# EAGLE schematic control_unit2 (EAGLE 5.11)

## Sheet 1 of 3
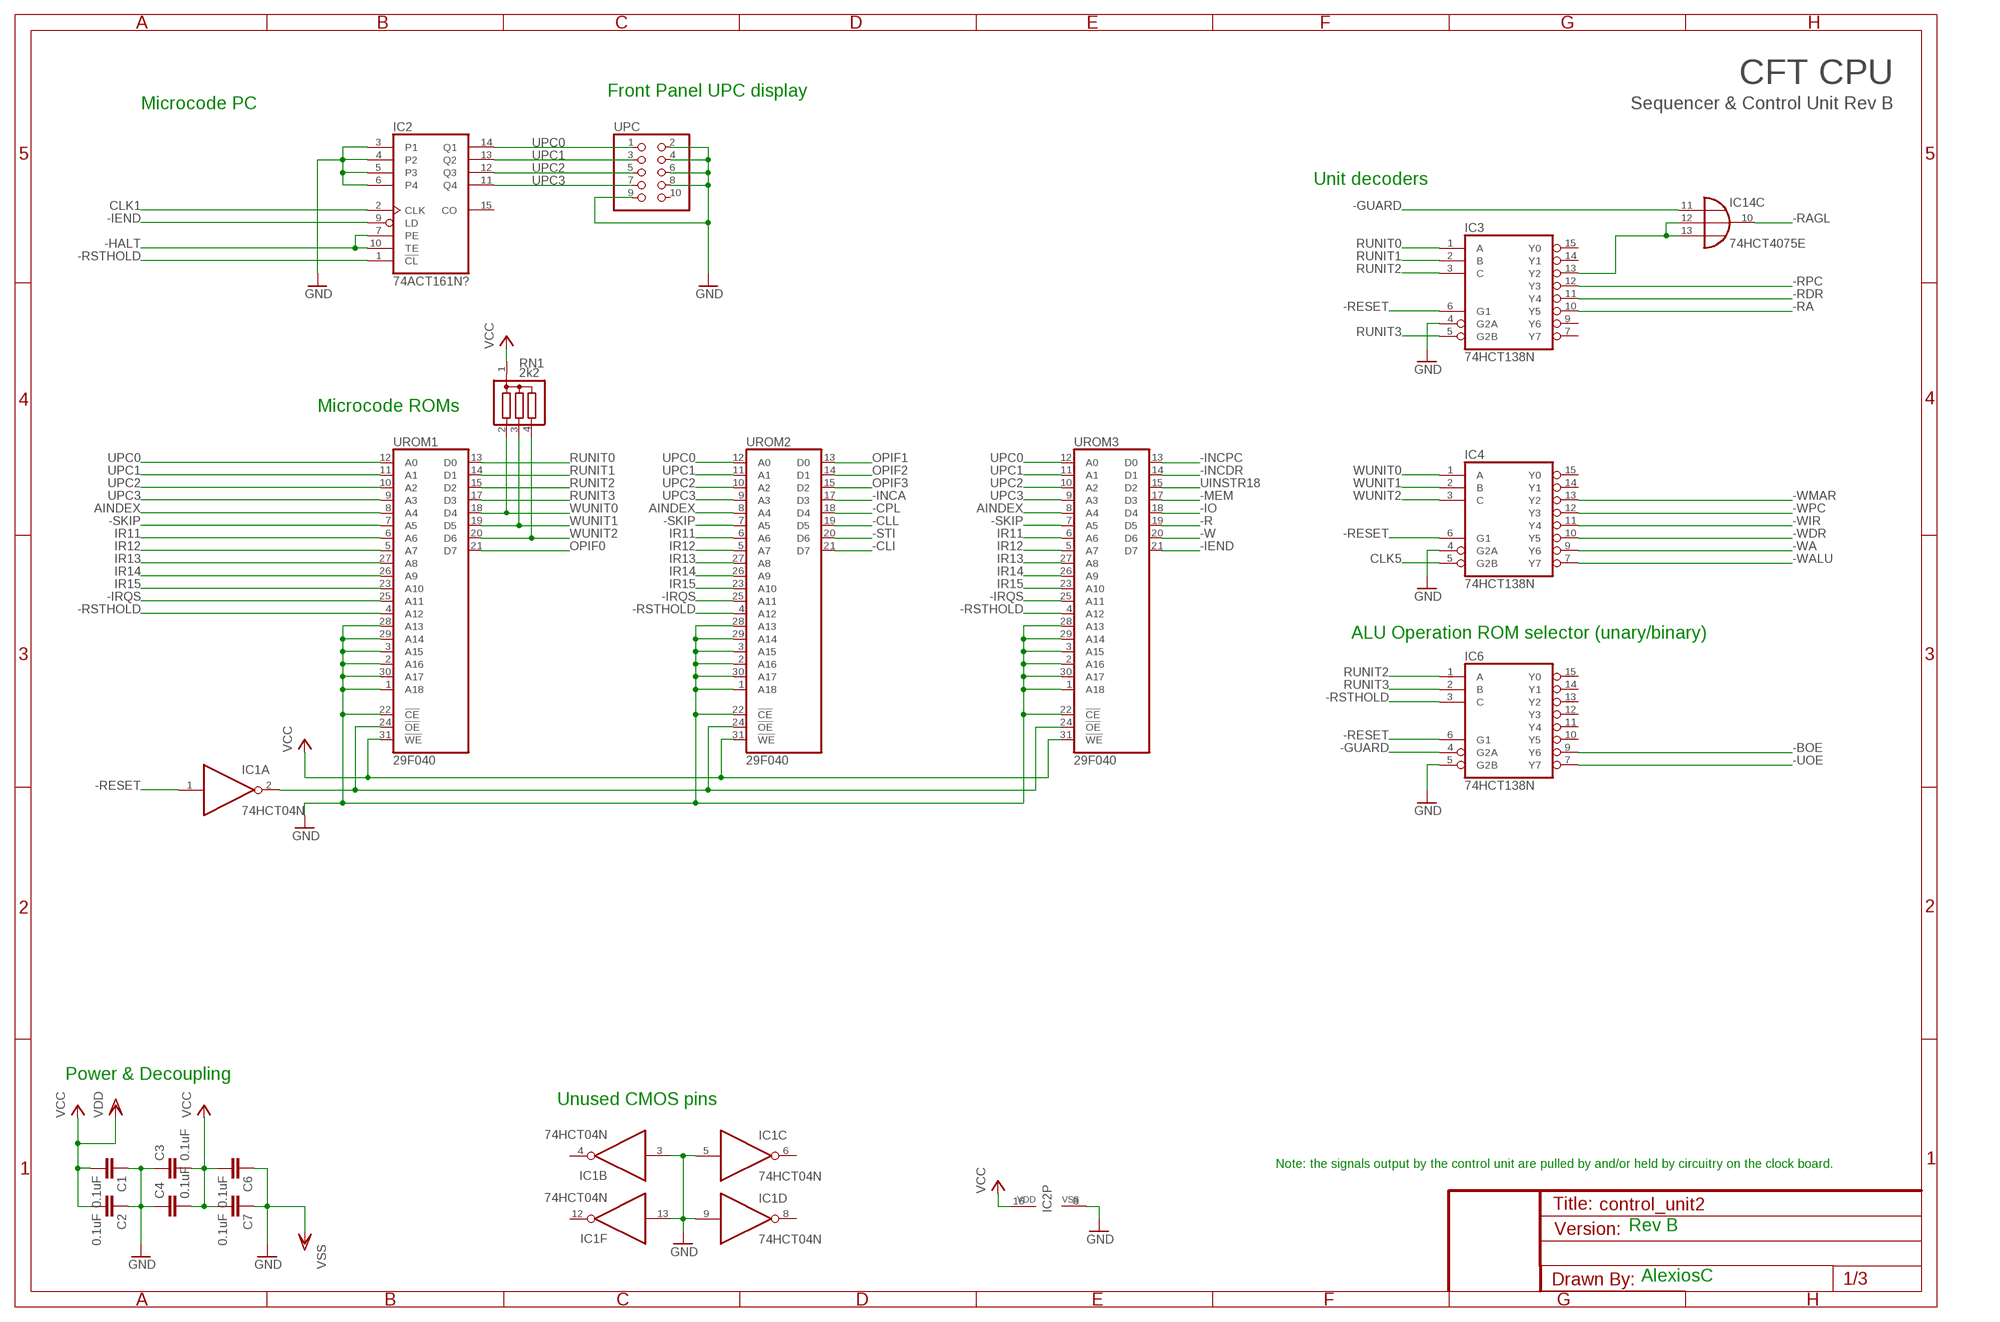
[diagram p0: schematic, sheet 1]

### Parts
C1  0.1uF  C-EU025-025X050  [C025-025X050]
C2  0.1uF  C-EU025-025X050  [C025-025X050]
C3  0.1uF  C-EU025-025X050  [C025-025X050]
C4  0.1uF  C-EU025-025X050  [C025-025X050]
C6  0.1uF  C-EU025-025X050  [C025-025X050]
C7  0.1uF  C-EU025-025X050  [C025-025X050]
IC1  74HCT04N  [DIL14]
IC2  74ACT161N?  4161P  [DIL16]
IC3  74HCT138N  [DIL16]
IC4  74HCT138N  [DIL16]
IC6  74HCT138N  [DIL16]
IC14  74HCT4075E  4075N  [DIL14]
RN1  2k2  G03R  [SIL4]
UPC  PINHD-2X5/90  [2X05/90]
UROM1  29F040  29F040DIP32  [DIL32]
UROM2  29F040  29F040DIP32  [DIL32]
UROM3  29F040  29F040DIP32  [DIL32]

### Nets
-BOE: IC6.9(Y6)
-CLI: UROM2.21(D7) ; also sheet 3
-CLL: UROM2.19(D5) ; also sheet 3
-CPL: UROM2.18(D4) ; also sheet 3
-GUARD: IC6.4(G2A) IC14.11(C:I0) ; also sheet 3
-HALT: IC2.7(PE) IC2.10(TE) ; also sheet 3
-IEND: IC2.9(LD) UROM3.21(D7) ; also sheet 3
-INCA: UROM2.17(D3) ; also sheet 3
-INCDR: UROM3.14(D1) ; also sheet 3
-INCPC: UROM3.13(D0) ; also sheet 3
-IO: UROM3.18(D4) ; also sheet 3
-IRQS: UROM1.25(A11) UROM2.25(A11) UROM3.25(A11) ; also sheet 3
-MEM: UROM3.17(D3) ; also sheet 3
-R: UROM3.19(D5) ; also sheet 3
-RA: IC3.10(Y5) ; also sheet 3
-RAGL: IC14.10(C:O) ; also sheet 3
-RDR: IC3.11(Y4) ; also sheet 3
-RESET: IC1.1(A:I) IC3.6(G1) IC4.6(G1) IC6.6(G1) ; also sheet 3
-RPC: IC3.12(Y3) ; also sheet 3
-RSTHOLD: IC2.1(!CL) IC6.3(C) UROM1.4(A12) UROM2.4(A12) UROM3.4(A12) ; also sheet 3
-SKIP: UROM1.7(A5) UROM2.7(A5) UROM3.7(A5) ; also sheet 3
-STI: UROM2.20(D6) ; also sheet 3
-UOE: IC6.7(Y7)
-W: UROM3.20(D6) ; also sheet 3
-WA: IC4.9(Y6) ; also sheet 3
-WALU: IC4.7(Y7) ; also sheet 3
-WDR: IC4.10(Y5) ; also sheet 3
-WIR: IC4.11(Y4) ; also sheet 3
-WMAR: IC4.13(Y2) ; also sheet 3
-WPC: IC4.12(Y3) ; also sheet 3
AINDEX: UROM1.8(A4) UROM2.8(A4) UROM3.8(A4) ; also sheet 3
CLK1: IC2.2(CLK) ; also sheet 3
CLK5: IC4.5(G2B) ; also sheet 3
GND [Power]: C1.1 C2.1 C3.1 C4.1 C6.1 C7.1 IC1.3(B:I) IC1.5(C:I) IC1.9(D:I) IC1.13(F:I) IC2.3(P1) IC2.4(P2) IC2.5(P3) IC2.6(P4) IC2.8(VSS) IC3.4(G2A) IC4.4(G2A) IC6.5(G2B) UPC.2 UPC.4 UPC.6 UPC.8 UPC.9 UROM1.1(A18) UROM1.2(A16) UROM1.3(A15) UROM1.22(!CE) UROM1.28(A13) UROM1.29(A14) UROM1.30(A17) UROM2.1(A18) UROM2.2(A16) UROM2.3(A15) UROM2.22(!CE) UROM2.28(A13) UROM2.29(A14) UROM2.30(A17) UROM3.1(A18) UROM3.2(A16) UROM3.3(A15) UROM3.22(!CE) UROM3.28(A13) UROM3.29(A14) UROM3.30(A17) ; supply symbol labelled VSS ; also sheet 3
IR11: UROM1.6(A6) UROM2.6(A6) UROM3.6(A6)
IR12: UROM1.5(A7) UROM2.5(A7) UROM3.5(A7)
IR13: UROM1.27(A8) UROM2.27(A8) UROM3.27(A8)
IR14: UROM1.26(A9) UROM2.26(A9) UROM3.26(A9)
IR15: UROM1.23(A10) UROM2.23(A10) UROM3.23(A10)
N$1: IC1.2(A:O) UROM1.24(!OE) UROM2.24(!OE) UROM3.24(!OE)
N$3: IC3.13(Y2) IC14.12(C:I1) IC14.13(C:I2)
OPIF0: UROM1.21(D7)
OPIF1: UROM2.13(D0)
OPIF2: UROM2.14(D1)
OPIF3: UROM2.15(D2)
RUNIT0: IC3.1(A) UROM1.13(D0) ; also sheet 3
RUNIT1: IC3.2(B) UROM1.14(D1) ; also sheet 3
RUNIT2: IC3.3(C) IC6.1(A) UROM1.15(D2) ; also sheet 3
RUNIT3: IC3.5(G2B) IC6.2(B) UROM1.17(D3) ; also sheet 3
UINSTR18: UROM3.15(D2) ; also sheet 3
UPC0: IC2.14(Q1) UPC.1 UROM1.12(A0) UROM2.12(A0) UROM3.12(A0)
UPC1: IC2.13(Q2) UPC.3 UROM1.11(A1) UROM2.11(A1) UROM3.11(A1)
UPC2: IC2.12(Q3) UPC.5 UROM1.10(A2) UROM2.10(A2) UROM3.10(A2)
UPC3: IC2.11(Q4) UPC.7 UROM1.9(A3) UROM2.9(A3) UROM3.9(A3)
VCC [Power]: C1.2 C2.2 C3.2 C4.2 C6.2 C7.2 IC2.16(VDD) RN1.1 UROM1.31(!WE) UROM2.31(!WE) UROM3.31(!WE) ; supply symbol labelled VDD ; also sheet 3
WUNIT0: IC4.1(A) RN1.2 UROM1.18(D4)
WUNIT1: IC4.2(B) RN1.3 UROM1.19(D5)
WUNIT2: IC4.3(C) RN1.4 UROM1.20(D6)
Unconnected: IC1.4(B:O) IC1.6(C:O) IC1.8(D:O) IC1.10(E:O) IC1.11(E:I) IC1.12(F:O) IC2.15(CO) IC3.7(Y7) IC3.9(Y6) IC3.14(Y1) IC3.15(Y0) IC4.14(Y1) IC4.15(Y0) IC6.10(Y5) IC6.11(Y4) IC6.12(Y3) IC6.13(Y2) IC6.14(Y1) IC6.15(Y0) IC14.1(A:I0) IC14.2(A:I1) IC14.3(B:I0) IC14.4(B:I1) IC14.5(B:I2) IC14.6(B:O) IC14.8(A:I2) IC14.9(A:O) UPC.10

### Notes on the sheet
- CFT CPU
- Front Panel UPC display
- Microcode PC | Sequencer & Control Unit Rev B
- Unit decoders
- Microcode ROMs
- ALU Operation ROM selector (unary/binary)
- Power & Decoupling
- Unused CMOS pins
- Note: the signals output by the control unit are pulled by and/or held by circuitry on the clock board.
- Rev B
- AlexiosC

## Sheet 2 of 3

## Sheet 3 of 3
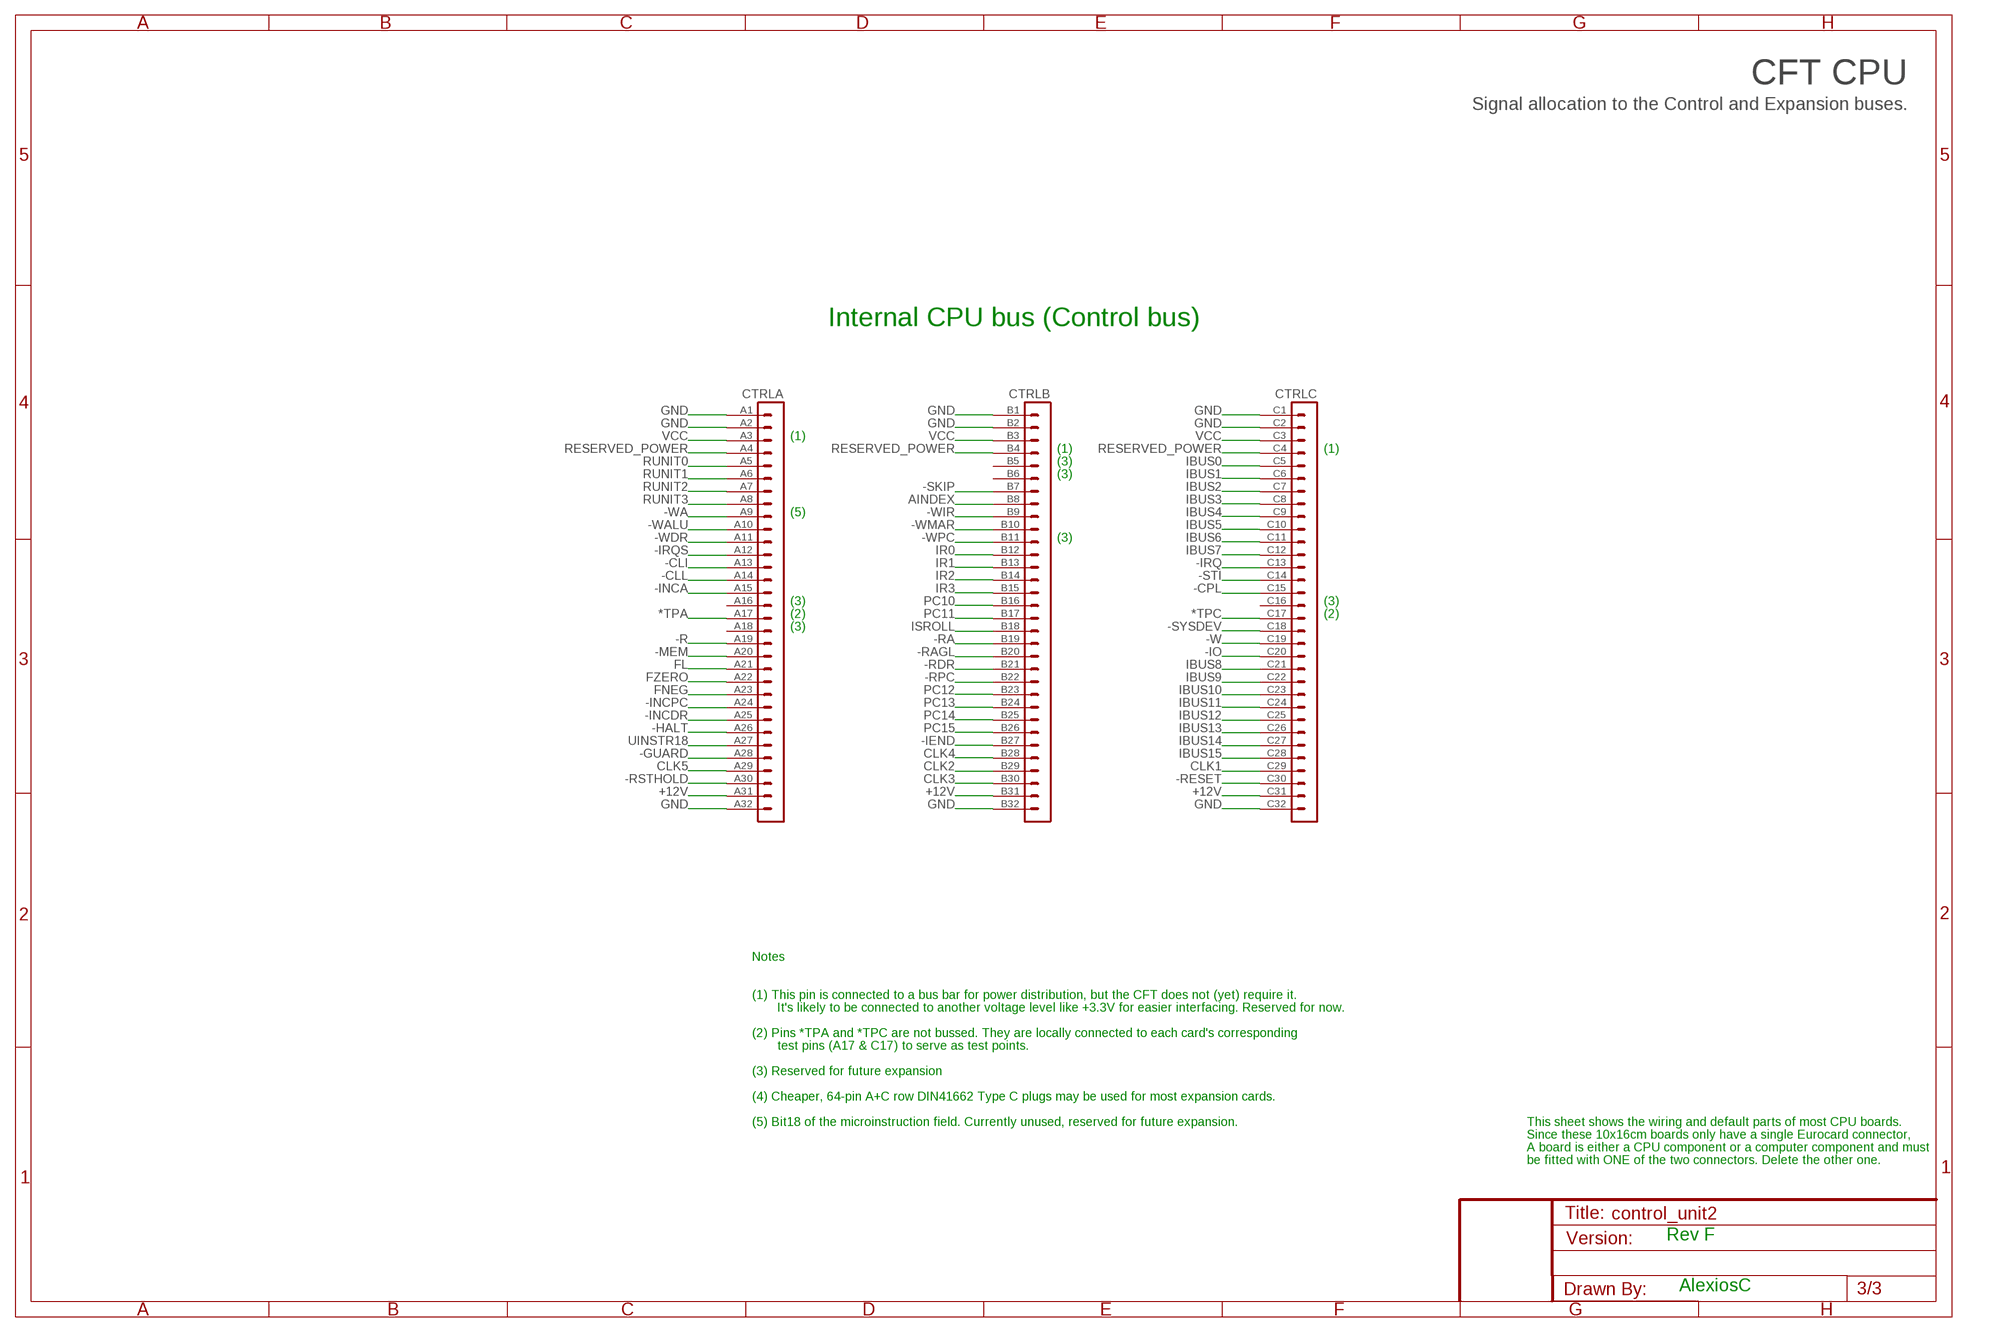
[diagram p1: schematic, sheet 3]

### Parts
CTRL  VG96-3B  [VG96B]

### Nets
*TPA: CTRL.A17
*TPC: CTRL.C17
+12V [12V]: CTRL.A31 CTRL.B31 CTRL.C31
-CLI: CTRL.A13 ; also sheet 1
-CLL: CTRL.A14 ; also sheet 1
-CPL: CTRL.C15 ; also sheet 1
-GUARD: CTRL.A28 ; also sheet 1
-HALT: CTRL.A26 ; also sheet 1
-IEND: CTRL.B27 ; also sheet 1
-INCA: CTRL.A15 ; also sheet 1
-INCDR: CTRL.A25 ; also sheet 1
-INCPC: CTRL.A24 ; also sheet 1
-IO: CTRL.C20 ; also sheet 1
-IRQ: CTRL.C13
-IRQS: CTRL.A12 ; also sheet 1
-MEM: CTRL.A20 ; also sheet 1
-R: CTRL.A19 ; also sheet 1
-RA: CTRL.B19 ; also sheet 1
-RAGL: CTRL.B20 ; also sheet 1
-RDR: CTRL.B21 ; also sheet 1
-RESET: CTRL.C30 ; also sheet 1
-RPC: CTRL.B22 ; also sheet 1
-RSTHOLD: CTRL.A30 ; also sheet 1
-SKIP: CTRL.B7 ; also sheet 1
-STI: CTRL.C14 ; also sheet 1
-SYSDEV: CTRL.C18
-W: CTRL.C19 ; also sheet 1
-WA: CTRL.A9 ; also sheet 1
-WALU: CTRL.A10 ; also sheet 1
-WDR: CTRL.A11 ; also sheet 1
-WIR: CTRL.B9 ; also sheet 1
-WMAR: CTRL.B10 ; also sheet 1
-WPC: CTRL.B11 ; also sheet 1
AINDEX: CTRL.B8 ; also sheet 1
CLK1: CTRL.C29 ; also sheet 1
CLK2: CTRL.B29
CLK3: CTRL.B30
CLK4: CTRL.B28
CLK5: CTRL.A29 ; also sheet 1
FL: CTRL.A21
FNEG: CTRL.A23
FZERO: CTRL.A22
GND [Power]: CTRL.A1 CTRL.A2 CTRL.A32 CTRL.B1 CTRL.B2 CTRL.B32 CTRL.C1 CTRL.C2 CTRL.C32 ; also sheet 1
IBUS0: CTRL.C5
IBUS1: CTRL.C6
IBUS2: CTRL.C7
IBUS3: CTRL.C8
IBUS4: CTRL.C9
IBUS5: CTRL.C10
IBUS6: CTRL.C11
IBUS7: CTRL.C12
IBUS8: CTRL.C21
IBUS9: CTRL.C22
IBUS10: CTRL.C23
IBUS11: CTRL.C24
IBUS12: CTRL.C25
IBUS13: CTRL.C26
IBUS14: CTRL.C27
IBUS15: CTRL.C28
IR0: CTRL.B12
IR1: CTRL.B13
IR2: CTRL.B14
IR3: CTRL.B15
ISROLL: CTRL.B18
PC10: CTRL.B16
PC11: CTRL.B17
PC12: CTRL.B23
PC13: CTRL.B24
PC14: CTRL.B25
PC15: CTRL.B26
RESERVED_POWER: CTRL.A4 CTRL.B4 CTRL.C4
RUNIT0: CTRL.A5 ; also sheet 1
RUNIT1: CTRL.A6 ; also sheet 1
RUNIT2: CTRL.A7 ; also sheet 1
RUNIT3: CTRL.A8 ; also sheet 1
UINSTR18: CTRL.A27 ; also sheet 1
VCC [Power]: CTRL.A3 CTRL.B3 CTRL.C3 ; also sheet 1
Unconnected: CTRL.A16 CTRL.A18 CTRL.B5 CTRL.B6 CTRL.C16

### Notes on the sheet
- CFT CPU
- Signal allocation to the Control and Expansion buses.
- Internal CPU bus (Control bus)
- (1)
- (1) | (1)
- (3)
- (3)
- (5)
- (3)
- (3) | (3)
- (2) | (2)
- (3)
- Notes
- (1) This pin is connected to a bus bar for power distribution, but the CFT does not (yet) require it.
- It's likely to be connected to another voltage level like +3.3V for easier interfacing. Reserved for now.
- (2) Pins *TPA and *TPC are not bussed. They are locally connected to each card's corresponding
- test pins (A17 & C17) to serve as test points.
- (3) Reserved for future expansion
- (4) Cheaper, 64-pin A+C row DIN41662 Type C plugs may be used for most expansion cards.
- (5) Bit18 of the microinstruction field. Currently unused, reserved for future expansion. | This sheet shows the wiring and default parts of most CPU boards.
- Since these 10x16cm boards only have a single Eurocard connector,
- A board is either a CPU component or a computer component and must
- be fitted with ONE of the two connectors. Delete the other one.
- Rev F
- AlexiosC

## Power pins joined to a net without a drawn wire
GND: IC1.7(P:GND) IC3.8(GND) IC4.8(GND) IC6.8(GND) IC14.7(P:VSS) UROM1.16(GND) UROM2.16(GND) UROM3.16(GND)
VCC: IC1.14(P:VCC) IC3.16(VCC) IC4.16(VCC) IC6.16(VCC) IC14.14(P:VDD) UROM1.32(VCC) UROM2.32(VCC) UROM3.32(VCC)

## Library data of the parts
C1-C4 C6 C7 = rcl:C-EU: CAPACITOR, European symbol
CTRL = 19inch:VG96-3: PCB EUROCARD, 96-pin type C/ABC, 2.54 mm
IC1 = 74xx-eu:74*04: Hex INVERTER
IC2 = 41xx:4161: 41xx DEVICE
IC3 IC4 IC6 = 74xx-eu:74*138: 3-line to 8-line DECODER/DEMULTIPLEXER
IC14 = 40xx:4075: Triple 3-input OR
RN1 = resistor-sil:G03R: SIL RESISTOR; OC_FARNELL: unknown; OC_NEWARK: unknown
UPC = pinhead:PINHD-2X5: PIN HEADER
UROM1-UROM3 = alexios:29F040: 4-mbit (512x8) Flash memory in a PLCC32 package (with socket). AM29F040 is an example of this.

## Net classes
0 default: width 0.305 mm, clearance 0.305 mm
1 Power: width 0.635 mm, clearance 0.635 mm
2 12V: width 0.635 mm, clearance 0.635 mm